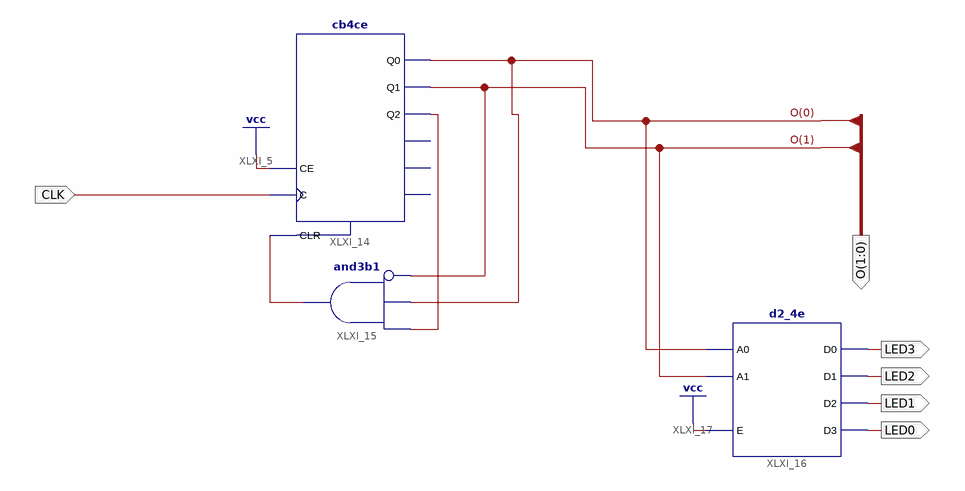
[diagram p0: schematic sheet 1]
// Xilinx ISE schematic Counter0_3.sch (spartan6) as structural Verilog: 3 symbols, 6 ports
module Counter0_3 (
  input  CLK,
  output [1:0] O,
  output LED3,
  output LED2,
  output LED1,
  output LED0
);

  wire XLXN_118, XLXN_120;

  cb4ce XLXI_14 (.C(CLK), .CE(1'b1), .CLR(XLXN_120), .Q0(O[0]), .Q1(O[1]), .Q2(XLXN_118));  // open: CEO, Q3, TC
  and XLXI_15 (XLXN_120, ~O[1], O[0], XLXN_118);  // and3b1
  d2_4e XLXI_16 (.A0(O[0]), .A1(O[1]), .E(1'b1), .D0(LED3), .D1(LED2), .D2(LED1), .D3(LED0));
endmodule
